# Altium schematic sheet Taksimetre.SchDoc: TAXIMETRE_PCB_MAIN
size A4; Author: YILDIRIM_DOGRU; CompanyName: BARFAS; DrawnBy: YILDIRIM_DOGRU; DocumentNumber: 0
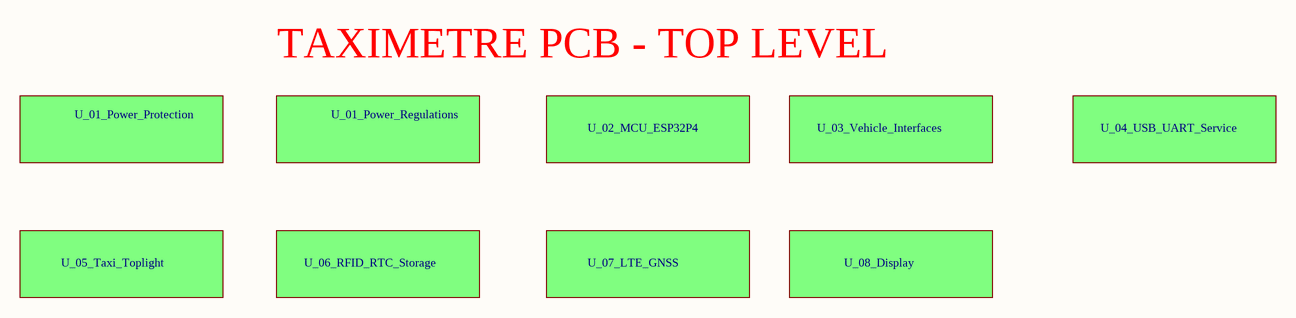
[diagram p0: Taksimetre.SchDoc]

## Sub-sheets
U_01_Power_Protection = 01_Power_Protection.SchDoc: no entries
U_01_Power_Regulations = 01_Power_Regulations.SchDoc: no entries
U_02_MCU_ESP32P4 = 02_MCU_ESP32P4.SchDoc: no entries
U_03_Vehicle_Interfaces = 03_Vehicle_Interfaces.SchDoc: no entries
U_04_USB_UART_Service = 04_USB_UART_Service.SchDoc: no entries
U_05_Taxi_Toplight = 05_Taxi_Toplight.SchDoc: no entries
U_06_RFID_RTC_Storage = 06_RFID_RTC_Storage.SchDoc: no entries
U_07_LTE_GNSS = 07_LTE_GNSS.SchDoc: no entries
U_08_Display = 08_Display.SchDoc: no entries

## Notes on the sheet
- TAXIMETRE PCB - TOP LEVEL
- Title
- Size:
- Date:
- A4
- Drawn By:
- Number:
- Revision:
- File: